# Altium schematic sheet Condor2_ESC.SchDoc
size A4
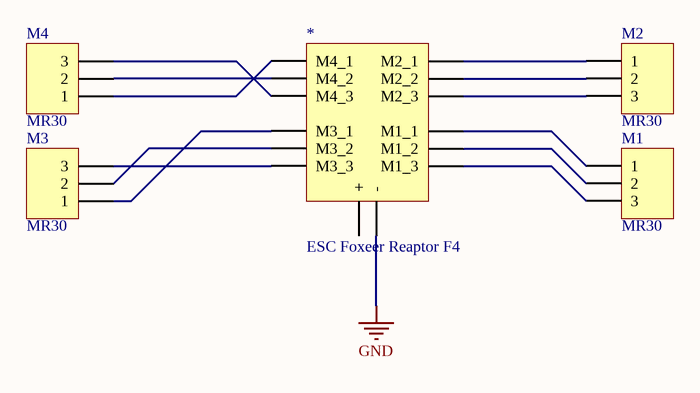
[diagram p0: Condor2_ESC.SchDoc]

## Parts
*  ESC Foxeer Reaptor F4  [FOXEeR REAPER]
M1  MR30  [MR30]
M2  MR30  [MR30]
M3  MR30  [MR30]
M4  MR30  [MR30]

## Nets
GND: *.8(-)
Net*_1: *.1(M4_1) M4.1
Net*_2: *.2(M4_2) M4.2
Net*_3: *.3(M4_3) M4.3
Net*_4: *.4(M3_1) M3.1
Net*_5: *.5(M3_2) M3.2
Net*_6: *.6(M3_3) M3.3
Net*_9: *.9(M1_3) M1.3
Net*_10: *.10(M1_2) M1.2
Net*_11: *.11(M1_1) M1.1
Net*_12: *.12(M2_3) M2.3
Net*_13: *.13(M2_2) M2.2
Net*_14: *.14(M2_1) M2.1

Not connected (* = marked no-connect by the designer): * 7(+)

## Library data of the parts
M1-M4 = MR30: LatestRevisionDate: 17-Jul-2002; LatestRevisionNote: Re-released for DXP Platform.; Publisher: Altium Limited